# EAGLE schematic encoder_debounce (EAGLE 6.4)
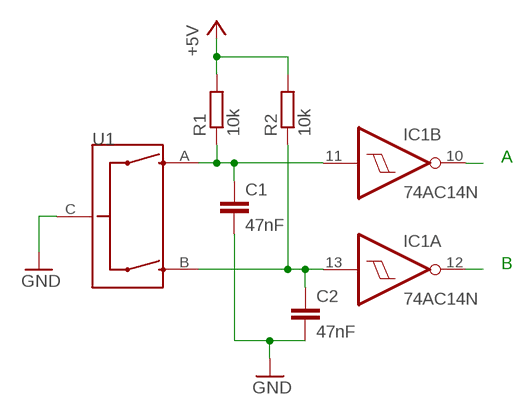
[diagram p0: schematic, sheet 1]

## Parts
C1  47nF  C-EU025-050X050  [C025-050X050]
C2  47nF  C-EU025-050X050  [C025-050X050]
IC1  74AC14N  [DIL14]
R1  10k  R-EU_0207/12  [0207/12]
R2  10k  R-EU_0207/12  [0207/12]
U1  ENCODER-QUADRATURE  [ENCODER-16MM-QUAD]

## Nets
+5V: R1.2 R2.2
GND: C1.2 C2.2 U1.C
N$1: C1.1 IC1.11(B:I) R1.1 U1.A
N$2: C2.1 IC1.13(A:I) R2.1 U1.B
N$6: IC1.10(B:O)
N$7: IC1.12(A:O)
Unconnected: IC1.1(D:I) IC1.2(D:O) IC1.3(E:I) IC1.4(E:O) IC1.5(F:I) IC1.6(F:O) IC1.8(C:O) IC1.9(C:I)

## Notes on the sheet
- A
- B

## Power pins joined to a net without a drawn wire
GND: IC1.7(P:GND)
VCC: IC1.14(P:VCC)

## Library data of the parts
C1 C2 = rcl:C-EU: CAPACITOR, European symbol
IC1 = 74xx-eu:74*14: Hex schmitt trigger INVERTER
R1 R2 = rcl:R-EU_: RESISTOR, European symbol
U1 = SparkFun-Electromechanical:ENCODER-QUADRATURE: quadrature encoder from Top-Up, part#EC16PHBF-B-20F-24-24C-16Y